# Altium schematic sheet PWR_SW.SchDoc
size A4; SheetNumber: 15; SheetTotal: 17
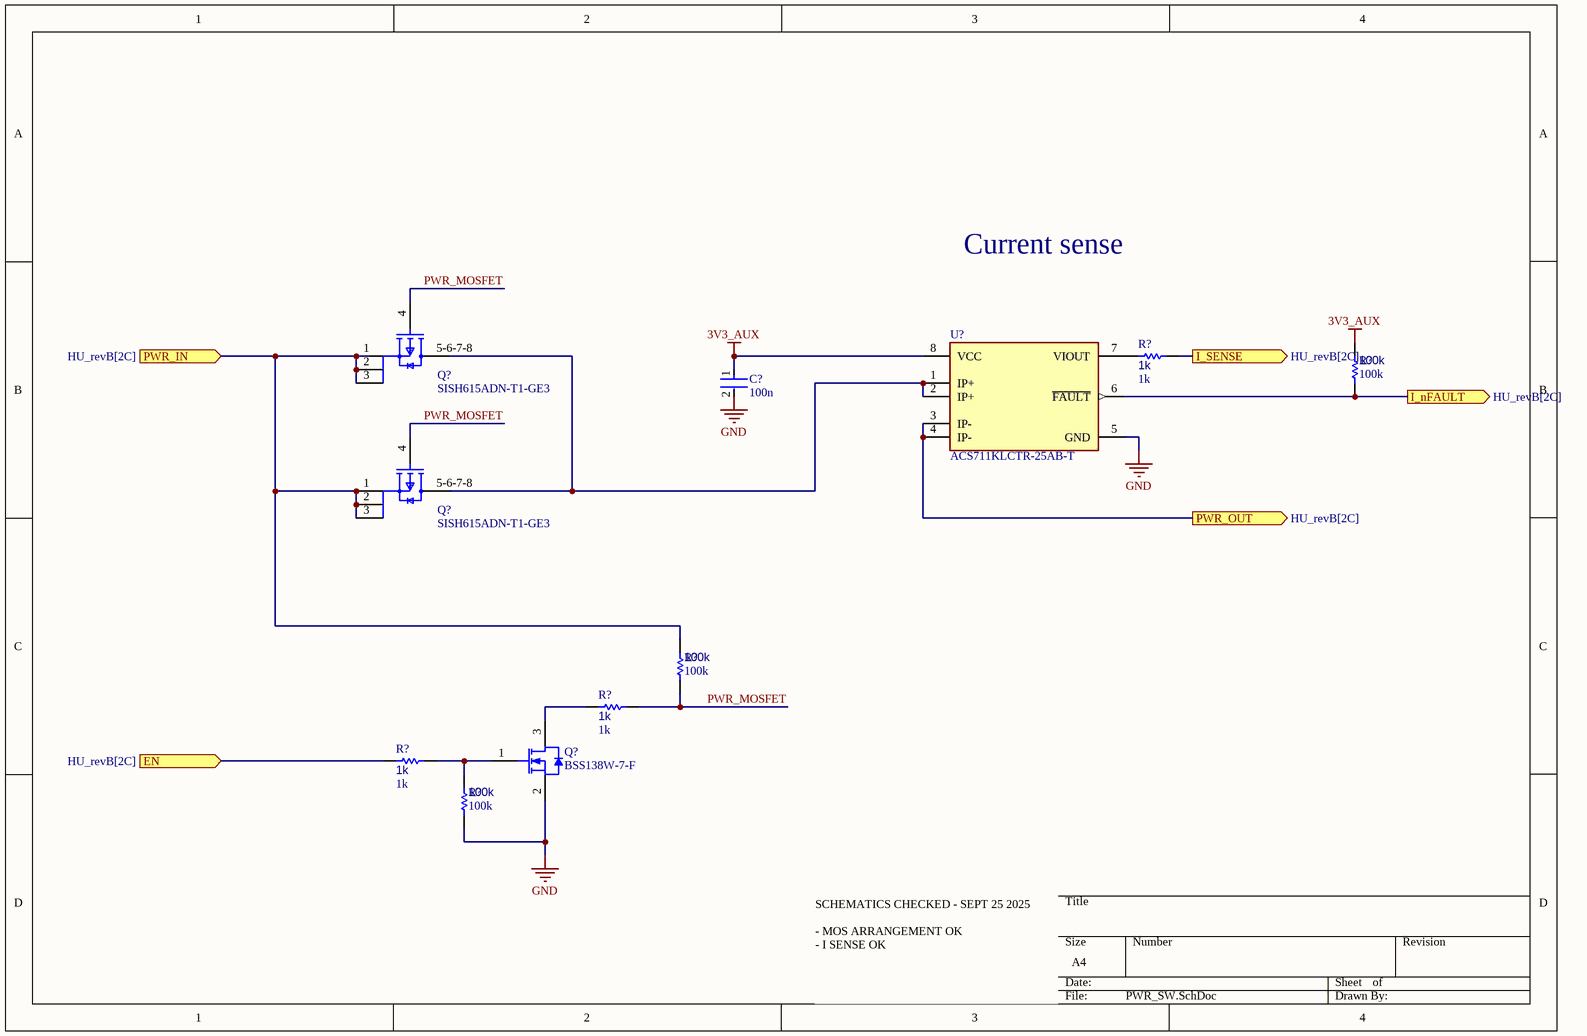
[diagram p0: PWR_SW.SchDoc]

## Parts
(Parts that share a designator on the sheet are numbered #1, #2 ... from top to bottom, then left to right.)
C?  100n  [FP-0402-L_1_0_0_05-W_0_5-IPC_A]
Q?#1  SISH615ADN-T1-GE3  [SISH615ADN-T1-GE3-Footprint-1]
Q?#2  SISH615ADN-T1-GE3  [SISH615ADN-T1-GE3-Footprint-1]
Q?#3  BSS138W-7-F  [DIOD-SOT323-3_V]
R?#1  1k  [R0603B]
R?#2  100k  [R0603B]
R?#3  100k  [R0603B]
R?#4  1k  [R0603B]
R?#5  1k  [R0603B]
R?#6  100k  [R0603B]
U?  ACS711KLCTR-25AB-T  [FP-LC-8-IPC_A]

## Ports
EN (in, see HU_revB[2C]), I_nFAULT (out, see HU_revB[2C]), I_SENSE (out, see HU_revB[2C]), PWR_IN (in, see HU_revB[2C]), PWR_OUT (out, see HU_revB[2C])

## Nets
3V3_AUX: C?.1 R?#2.2 U?.8(VCC)
GND: C?.2 Q?#3.2(S) R?#6.1 U?.5(GND)
EN: R?#5.1 ; port EN
I_nFAULT: R?#2.1 U?.6(~{FAULT}) ; port I_nFAULT
I_SENSE: R?#1.1 ; port I_SENSE
PWR_IN: Q?#1.1(S) Q?#1.2(S) Q?#1.3(S) Q?#2.1(S) Q?#2.2(S) Q?#2.3(S) R?#3.2 ; port PWR_IN
PWR_MOSFET: Q?#1.4(G) Q?#2.4(G) R?#3.1 R?#4.2
PWR_OUT: U?.3(IP-) U?.4(IP-) ; port PWR_OUT
NetQ?#1_5-6-7-8: Q?#1.5-6-7-8(D) Q?#2.5-6-7-8(D) U?.1(IP+) U?.2(IP+)
NetQ?#3_1: Q?#3.1(G) R?#5.2 R?#6.2
NetQ?#3_3: Q?#3.3(D) R?#4.1
NetR?#1_2: R?#1.2 U?.7(VIOUT)

## Notes on the sheet
- Current sense
- SCHEMATICS CHECKED - SEPT 25 2025
  - MOS ARRANGEMENT OK
  - I SENSE OK

## Library data of the parts
C? = CMP-001-00058-1: LARGE PADS, 0402 CAP, CHANGE COMMENT TO MATCH REAL P/N; Capacitor Type: Ceramic; Min Operating Temperature: -55°C; Mounting Technology: Surface Mount; Pins: 2; Case/Package: 0402; RoHS Compliant: Yes; Max Operating Temperature: 85°C
Q?#1 Q?#2 = CMP-013-00018-2: Trans MOSFET P-CH 20V 22.1A 8-Pin PowerPAK 1212 EP T/R; Source: SISH615ADN-T1-GE3.SchLib; Design Item ID: CMP-013-00036-4; Component Type: Standard; Pins: 5
Q?#3 = CMP-2000-05968-1: N-Channel Enhancement Mode Mosfet, 50 V, 200 mA, -55 to 150 degC, 6-Pin SOT-323, RoHS, Tape and Reel; Typical Turn-Off Delay Time: 20ns; Number of Channels: 1Channel; Type: EnhancementModeFieldEffectTransistor; Brand: DiodesIncorporated; Vds - Drain-Source Breakdown Voltage: 75V; Vgs - Gate-Source Voltage: 20V; Rds On - Drain-Source Resistance: 1.4Ohms; Transistor Type: 1N-Channel; Configuration: Single; Unit Weight: 0.000212oz; Pd - Power Dissipation: 200mW; Id - Continuous Drain Current: 200mA; Forward Transconductance - Min: 0.1S; Manufacturer URL: http://www.diodes.com/; Series: BSS138; Package Description: 3-Pin Small Outline Transistor, Body 2 x 1.25 mm, Pitch 0.65 mm; Mounting Technology: SurfaceMount; Product Category: MOSFET; RoHS: True; Maximum Operating Temperature: +150C; Height: 1mm; Length: 2.2mm; Technology: Si; Width: 1.35mm; Datasheet URL: http://www.diodes.com/_files/datasheets/ds30206.pdf; Manufacturer: DiodesIncorporated; Package / Case: SOT-323-3; Typical Turn-On Delay Time: 20ns; Transistor Polarity: N-Channel; Factory Pack Quantity: 3000; Packaging: Reel; Product: MOSFETSmallSignal; Datasheet Version: Rev. 11-2, 09/2013; Package Reference: SOT323; Minimum Operating Temperature: -55C; Mounting Style: SMD/SMT; Channel Mode: Enhancement
R?#1-R?#6 = CMP-009-00002-14: Resistor
  R?#1 R?#4 R?#5: Value: 1k
  R?#2 R?#3 R?#6: Value: 100k
U? = CMP-1557-00015-2: SENSOR CURRENT HALL 25A AC/DC; Bandwidth: 100kHz; Min Supply Voltage: 3V; Polarity: Bidirectional; Max Supply Voltage: 5.5V; Max Supply Current: 5.5mA; Number of Channels: 1; Quiescent Current: 4mA; Sensitivity: 55mV/A; Accuracy: 4%; Linearity: 1%; Operating Supply Voltage: 3.3V; Response Time: 4.6us; Case/Package: SOIC; Min Operating Temperature: -40°C; RoHS Compliant: Yes; Length: 4.9mm; Package Quantity: 1; Number of Pins: 8; Width: 3.9mm; REACH SVHC: No SVHC; -3db Bandwidth: 100kHz; Series: -; Packaging: Tape and Reel; Max Operating Temperature: 125°C; Current Sensing: 25A; Height: 1.5mm; Frequency: 100kHz